# Altium schematic sheet powerAMP.SchDoc
size 297 x 209 mm
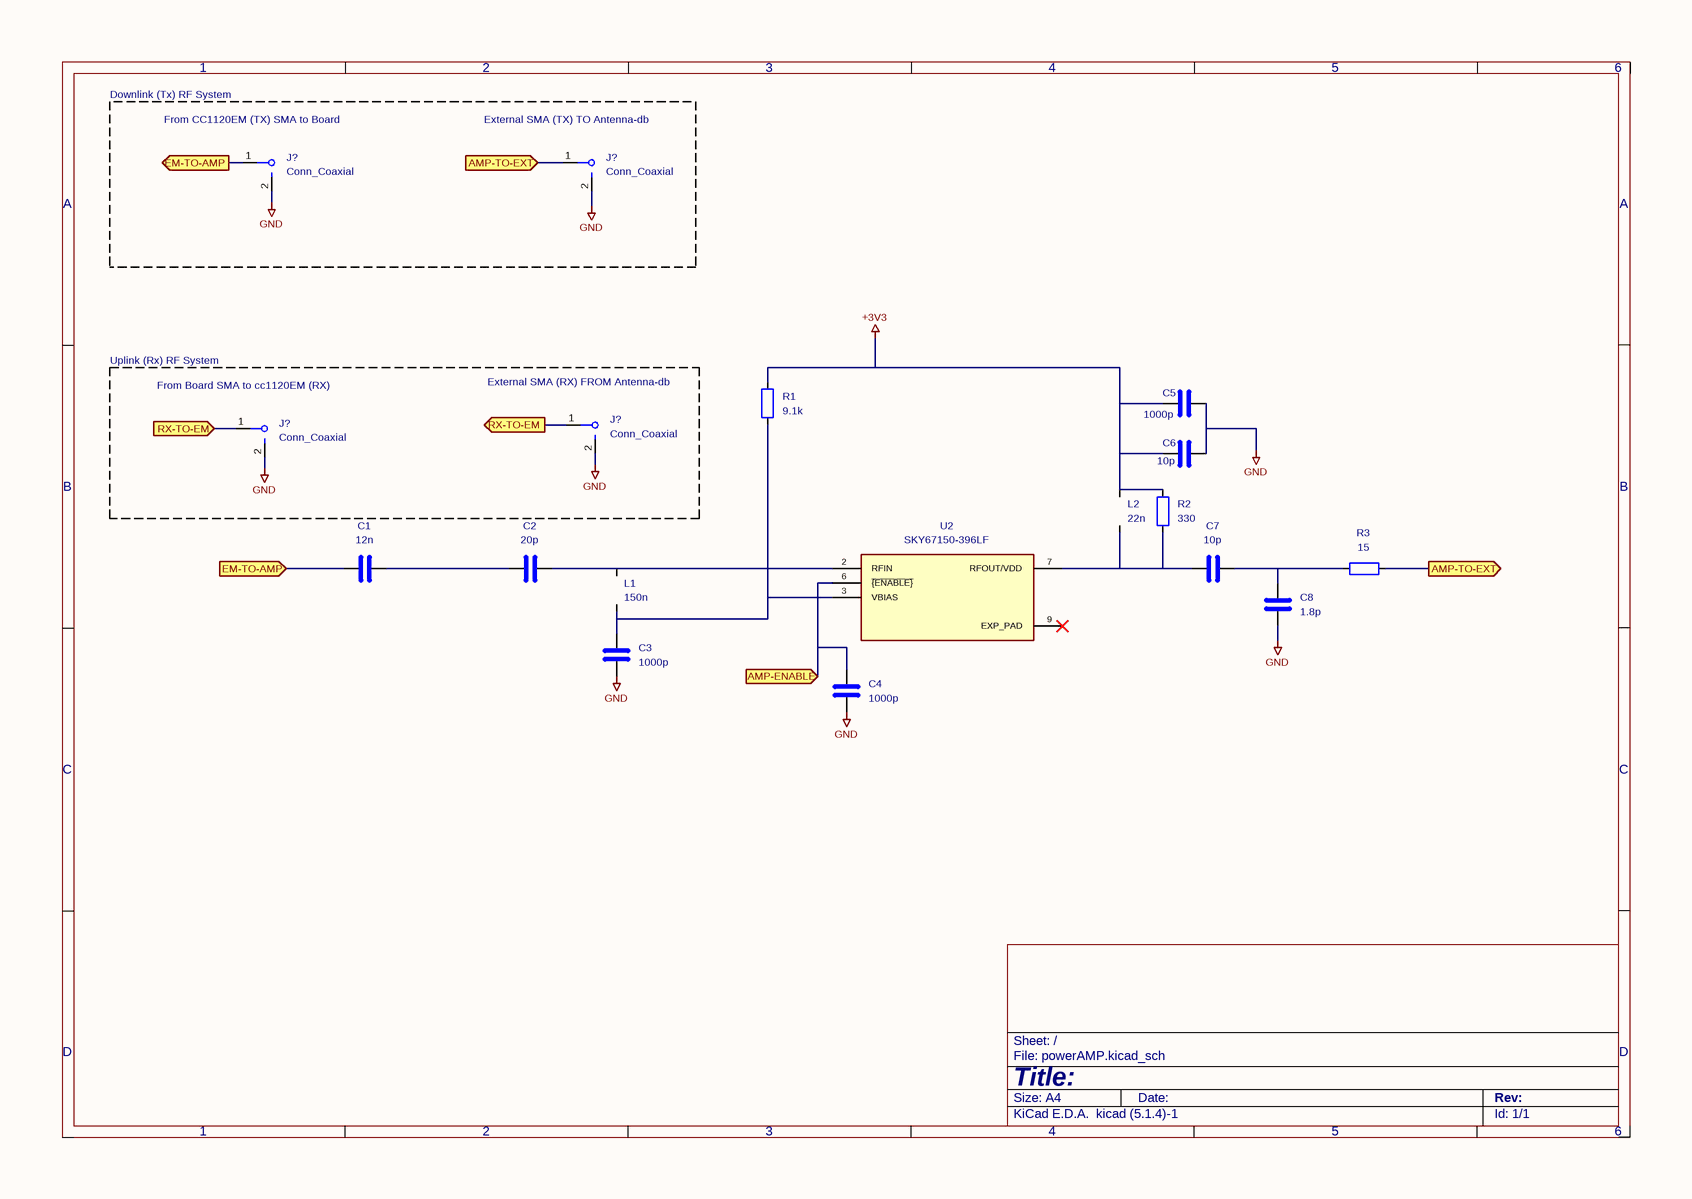
[diagram p0: powerAMP.SchDoc]

## Parts
(Parts that share a designator on the sheet are numbered #1, #2 ... from top to bottom, then left to right.)
C1  12n
C2  20p
C3  1000p
C4  1000p
C5  1000p
C6  10p
C7  10p
C8  1.8p
J?#1  Conn_Coaxial  [SMA_Amphenol_132134-10_Vertical]
J?#2  Conn_Coaxial  [SMA_Amphenol_132134-10_Vertical]
J?#3  Conn_Coaxial  [SMA_Amphenol_132134-10_Vertical]
J?#4  Conn_Coaxial  [SMA_Amphenol_132134-10_Vertical]
L1  150n
L2  22n
R1  9.1k
R2  330
R3  15
U2  SKY67150-396LF  [SON50P200X200X80-9N]

## Ports
AMP-ENABLE (in), AMP-TO-EXT (in), AMP-TO-EXT (out), EM-TO-AMP (in), EM-TO-AMP (out), RX-TO-EM (in), RX-TO-EM (out)

## Nets
+3V3: C5.1 C6.1 L2.1 R1.1 R2.1
GND: C3.2 C4.2 C5.2 C6.2 C8.2 J?#1.2(Ext) J?#2.2(Ext) J?#3.2(Ext) J?#4.2(Ext)
AMP-ENABLE: C4.1 U2.6(~{{ENABLE}}) ; port AMP-ENABLE
AMP-TO-EXT: J?#2.1(In) R3.2 ; port AMP-TO-EXT
EM-TO-AMP: C1.2 J?#1.1(In) ; port EM-TO-AMP
RX-TO-EM: J?#3.1(In) J?#4.1(In) ; port RX-TO-EM
NetC1_1: C1.1 C2.1
NetC2_2: C2.2 L1.1 U2.2(RFIN)
NetC3_1: C3.1 L1.2 R1.2 U2.3(VBIAS)
NetC7_1: C7.1 L2.2 R2.2 U2.7(RFOUT/VDD)
NetC7_2: C7.2 C8.1 R3.1

Not connected (* = marked no-connect by the designer): U2 9(EXP_PAD)*

## Notes on the sheet
- Downlink (Tx) RF System
- (near J?#1) From CC1120EM (TX) SMA to Board
- (near J?#2) External SMA (TX) TO Antenna-db
- Uplink (Rx) RF System
- (near J?#4) From Board SMA to cc1120EM (RX)
- (near J?#3) External SMA (RX) FROM Antenna-db
- 1
- 2
- 3
- 4
- 5
- 6
- A
- B
- C
- D
- Title:
- File: powerAMP.kicad_sch
- Sheet: /
- KiCad E.D.A.  kicad (5.1.4)-1
- Size: A4
- Date:
- Rev:
- Id: 1/1

## Library data of the parts
C1-C8 = C
  C1: Value: 12n
  C2: Value: 20p
  C3-C5: Value: 1000p
  C6 C7: Value: 10p
  C8: Value: 1.8p
L1 L2 = L
  L1: Value: 150n
  L2: Value: 22n
R1-R3 = R
  R1: Value: 9.1k
  R2: Value: 330
  R3: Value: 15
U2 = SKY67150-396LF: MANUFACTURER: Skyworks; SNAPEDA_PACKAE_ID: 8744; STANDARD: IPC-7351B; PARTREV: May 3,2017; Value: SKY67150-396LF
J?#1-J?#4 = Conn_Coaxial: Value: Conn_Coaxial; Footprint: Connector_Coaxial:SMA_Amphenol_132134-10_Vertical